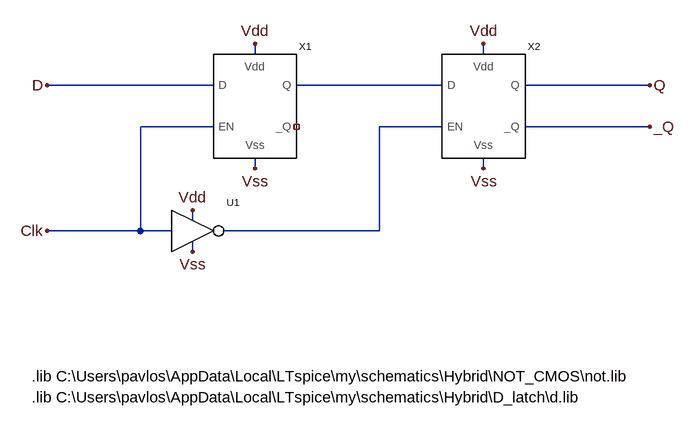
[diagram p0: schematic DFF.asc]
DFF.asc, the LTspice schematic file:
Version 4
SHEET 1 880 680
WIRE -384 -208 -384 -224
WIRE -32 -208 -32 -224
WIRE -448 -160 -704 -160
WIRE -96 -160 -320 -160
WIRE 224 -160 32 -160
WIRE -448 -96 -560 -96
WIRE -96 -96 -192 -96
WIRE 224 -96 32 -96
WIRE -384 -32 -384 -48
WIRE -32 -32 -32 -48
WIRE -480 48 -480 32
WIRE -560 64 -560 -96
WIRE -560 64 -704 64
WIRE -512 64 -560 64
WIRE -192 64 -192 -96
WIRE -192 64 -432 64
WIRE -480 96 -480 80
FLAG -384 -224 Vdd
FLAG -32 -224 Vdd
FLAG -480 32 Vdd
FLAG -480 96 Vss
FLAG -384 -32 Vss
FLAG -32 -32 Vss
FLAG -704 64 Clk
FLAG -704 -160 D
FLAG 224 -160 Q
FLAG 224 -96 _Q
SYMBOL d -448 -48 R0
SYMATTR InstName X1
SYMBOL d -96 -48 R0
SYMATTR InstName X2
SYMBOL not -512 96 R0
SYMATTR InstName U1
TEXT -728 288 Left 2 !.lib C:\\Users\\pavlos\\AppData\\Local\\LTspice\\my\\schematics\\Hybrid\\NOT_CMOS\\not.lib
TEXT -728 320 Left 2 !.lib C:\\Users\\pavlos\\AppData\\Local\\LTspice\\my\\schematics\\Hybrid\\D_latch\\d.lib

The netlist it stands for:
* DFF.asc
XX1 D Clk N001 NC_01 Vdd Vss d  ; pins D EN Q _Q Vdd Vss
XX2 N001 N002 Q _Q Vdd Vss d  ; pins D EN Q _Q Vdd Vss
XU1 Clk N002 Vdd Vss not  ; pins A Y Vdd Vss
.lib C:\Users\pavlos\AppData\Local\LTspice\my\schematics\Hybrid\NOT_CMOS\not.lib
.lib C:\Users\pavlos\AppData\Local\LTspice\my\schematics\Hybrid\D_latch\d.lib
.backanno
.end